# Altium project Fri3D_2026_02.PrjPcb
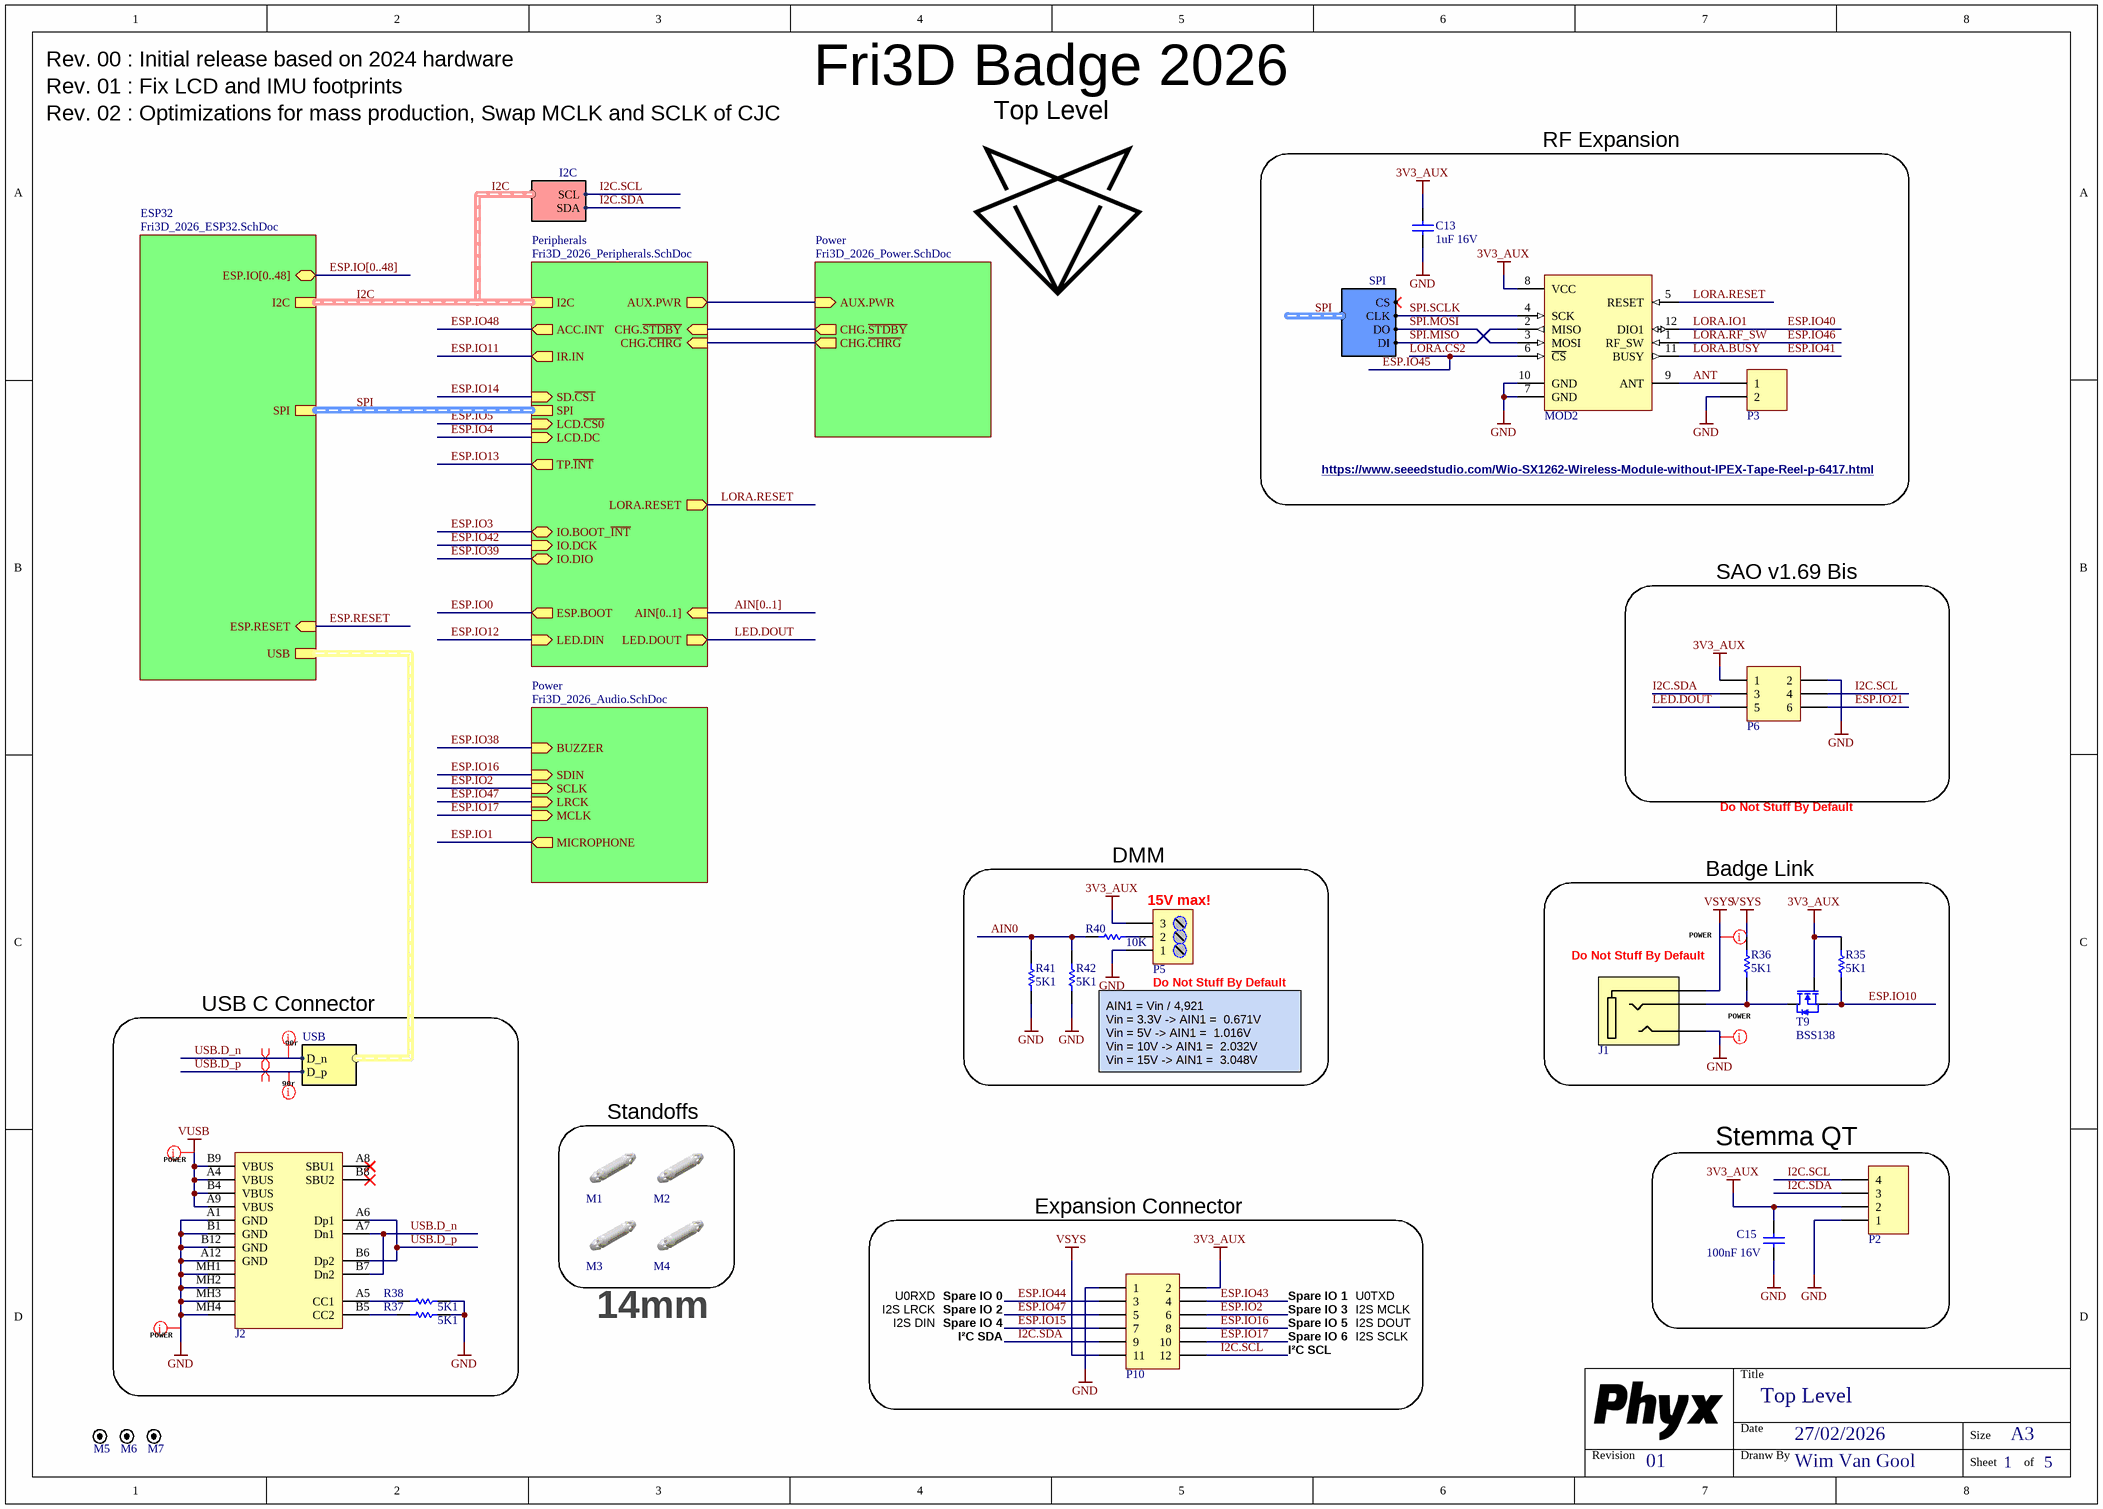
[diagram p0: Fri3D_2026_02.SchDoc]
PCB_ENGINEER: WimVG; PCB_REV: 02; PCB_TITLE: Fri3D Badge 2026
5 sheets, 122 parts. Net scope: hierarchical (ports join the sheet entries above them; power ports are global).
Board file: Fri3D_2026_02.PcbDoc
Sheets:
  Fri3D_2026_02.SchDoc
    Peripherals = Fri3D_2026_Peripherals.SchDoc
    Power = Fri3D_2026_Power.SchDoc
    ESP32 = Fri3D_2026_ESP32.SchDoc
    Power = Fri3D_2026_Audio.SchDoc

## Sheet Fri3D_2026_02.SchDoc: Top Level
size A3; Date: 27/02/2026; DrawnBy: Wim Van Gool; DocumentNumber: 1; Revision: 01; SheetNumber: 1; SheetTotal: 5

### Parts
C13  value 1uF 16V  [C0603_N]
C15  value 100nF 16V  [C0603_N]
J1  3.5mm jack, black, 3 contacts  [SHOU_HAN_PJ-320A-3P]  (value not drawn)
J2  USB 2.0 C Reversible Receptacle Horizontal full SMD  [XUNPU-TYPEC-304S-ACP16]  (value not drawn)
M1  HIWA LCC-12 Snap-in - Snap-in 12.7mm  [WE_709622400]  (value not drawn)
M2  HIWA LCC-12 Snap-in - Snap-in 12.7mm  [WE_709622400]  (value not drawn)
M3  HIWA LCC-12 Snap-in - Snap-in 12.7mm  [WE_709622400]  (value not drawn)
M4  HIWA LCC-12 Snap-in - Snap-in 12.7mm  [WE_709622400]  (value not drawn)
M5  Fiducial 0.5mm  [FID_0.5mm]  (value not drawn)
M6  Fiducial 0.5mm  [FID_0.5mm]  (value not drawn)
M7  Fiducial 0.5mm  [FID_0.5mm]  (value not drawn)
MOD2  868/915MHz 22dBm LoRa Module with Antenna Pin  [SEE_Wio-SX1262]  (value not drawn)
P2  Header 1.0mm RA Shrouded 4  [WE_665104131822]  (value not drawn)
P3  DEALON DL-SMA-K513-08K  [DEA_DL-SMA-K513-08K]  (value not drawn)
P5  3 Way Screw HDR 3.5mm Rising Cage  [WE_691103110003]  (value not drawn)
P6  Receptacle 3x2  [RCPT2X3]  (value not drawn)
P10  Receptacle 6x2 SMD low profile  [WE_610312243021_POST]  (value not drawn)
R35  value 5K1  [R0603_N]
R36  value 5K1  [R0603_N]
R37  value 5K1  [R0603_N]
R38  value 5K1  [R0603_N]
R40  value 10K  [R0603_N]
R41  value 5K1  [R0603_N]
R42  value 5K1  [R0603_N]
T9  value BSS138  [SOT23-3]  (hidden comment: 0.2A N-Ch MOSFET Vgs 3.2)

### Blocks framed on the sheet
RF Expansion: C13 MOD2 P3
SAO v1.69 Bis: P6
DMM: P5 R40-R42
Badge Link: J1 R35 R36 T9
USB C Connector: J2 R37 R38
Standoffs: M1-M4
Stemma QT: C15 P2
Expansion Connector: P10

### Sub-sheets
ESP32 = Fri3D_2026_ESP32.SchDoc: I2C (harness I2C), USB (harness USB), SPI (harness SPI), ESP.RESET (in), ESP.IO[0..48] (bidir)
Peripherals = Fri3D_2026_Peripherals.SchDoc: I2C (harness I2C), ACC.INT (out), LED.DIN (in), LED.DOUT (out), SPI (harness SPI), IR.IN (out), LCD.DC (in), LCD.~{CS0} (in), ESP.BOOT (out), SD.~{CS1} (in), IO.BOOT_~{INT} (bidir), IO.DCK (in), IO.DIO (bidir), AUX.PWR (out), TP.~{INT} (out), CHG.~{STDBY} (in), CHG.~{CHRG} (in), AIN[0..1] (in), LORA.RESET (out)
Power = Fri3D_2026_Power.SchDoc: AUX.PWR (in), CHG.~{STDBY} (out), CHG.~{CHRG} (out)
Power = Fri3D_2026_Audio.SchDoc: BUZZER (in), MICROPHONE (out), SDIN (in), SCLK (in), LRCK (in), MCLK (in)

### Harnesses
USB: D_p, D_n
I2C: SDA, SCL
SPI: CS, CLK, DO, DI

### Nets
3V3_AUX: C13.1 C15.1 MOD2.8(VCC) P2.2 P5.3 P6.1 P10.2 R35.1 T9.1(G)
GND: C13.2 C15.2 J1.2(Tip) J2.A1(GND) J2.A12(GND) J2.B1(GND) J2.B12(GND) J2.MH1(Tab) J2.MH2(Tab) J2.MH3(Tab) J2.MH4(Tab) MOD2.7(GND) MOD2.10(GND) P2.1 P3.2 P5.1 P6.2 P10.1 R37.2 R38.2 R41.1 R42.1
VSYS: J1.1(Sleeve) P10.11 R36.1
VUSB: J2.A4(VBUS) J2.A9(VBUS) J2.B4(VBUS) J2.B9(VBUS)
AIN0: R40.1 R41.2 R42.2
ANT: MOD2.9(ANT) P3.1
AUX.PWR: sheet Peripherals/AUX.PWR, sheet Power/AUX.PWR
~{CHRG}: sheet Peripherals/CHG.~{CHRG}, sheet Power/CHG.~{CHRG}
CHG.~{STDBY}: sheet Peripherals/CHG.~{STDBY}, sheet Power/CHG.~{STDBY}
ESP.IO2: P10.6 ; sheet Power/SCLK
ESP.IO10: R35.2 T9.2(S)
ESP.IO15: P10.7
ESP.IO16: P10.8 ; sheet Power/SDIN
ESP.IO17: P10.10 ; sheet Power/MCLK
ESP.IO21: P6.6
ESP.IO40: MOD2.12(DIO1)  [also labelled LORA.IO1]
ESP.IO41: MOD2.11(BUSY)  [also labelled LORA.BUSY]
ESP.IO43: P10.4
ESP.IO44: P10.3
ESP.IO45: MOD2.6(~{CS})  [also labelled LORA.~{CS2}]
ESP.IO46: MOD2.1(RF_SW)  [also labelled LORA.RF_SW]
ESP.IO47: P10.5 ; sheet Power/LRCK
I2C.SCL: P2.4 P6.4 P10.12 ; sheet Peripherals/I2C.SCL
I2C.SDA: P2.3 P6.3 P10.9 ; sheet Peripherals/I2C.SDA
LED.DOUT: P6.5 ; sheet Peripherals/LED.DOUT
LORA.RESET: MOD2.5(RESET) ; sheet Peripherals/LORA.RESET
SPI.MISO: MOD2.2(MISO) ; sheet Peripherals/SPI.DI  [project net ESP.IO8]
SPI.MOSI: MOD2.3(MOSI) ; sheet Peripherals/SPI.DO  [project net ESP.IO6]
SPI.SCLK: MOD2.4(SCK) ; sheet Peripherals/SPI.CLK  [project net ESP.IO7]
USB.D_n: J2.A7(Dn1) J2.B7(Dn2) ; sheet ESP32/USB.D_n
USB.D_p: J2.A6(Dp1) J2.B6(Dp2) ; sheet ESP32/USB.D_p
NetJ1_3: J1.3(Ring) R36.2 T9.3(D)
NetJ2_A5: J2.A5(CC1) R38.1
NetJ2_B5: J2.B5(CC2) R37.1
NetP5_2: P5.2 R40.2

Not connected (* = marked no-connect by the designer): J2 A8(SBU1)* B8(SBU2)*

### Buses and harness runs
bus AIN[0..1] = sheet Peripherals/AIN[0..1]
bus ESP.IO[0..48] = sheet ESP32/ESP.IO[0..48]
harness I2C = sheet ESP32/I2C = sheet Peripherals/I2C
harness SPI = sheet ESP32/SPI = sheet Peripherals/SPI

### Layout directives
net class 90r: USB.D_n, USB.D_p
differential pair: USB.D_n, USB.D_p
net class POWER: GND, VSYS, VUSB

### Notes on the sheet
- Rev. 00 : Initial release based on 2024 hardware
- Rev. 01 : Fix LCD and IMU footprints
- Rev. 02 : Optimizations for mass production, Swap MCLK and SCLK of CJC
- https://www.seeedstudio.com/Wio-SX1262-Wireless-Module-without-IPEX-Tape-Reel-p-6417.html
- Do Not Stuff By Default
- (near P5) 15V max!
- (near P5) Do Not Stuff By Default
- AIN1 = Vin / 4,921
  Vin = 3.3V -> AIN1 =  0.671V
  Vin = 5V -> AIN1 =  1.016V
  Vin = 10V -> AIN1 =  2.032V
  Vin = 15V -> AIN1 =  3.048V
- 14mm
- I2S LRCK
- I2S DIN
- U0RXD
- Spare IO 0
- I²C SDA
- Spare IO 2
- Spare IO 4
- Spare IO 1
- Spare IO 3
- Spare IO 5
- Spare IO 6
- I2S MCLK
- I2S SCLK
- I2S DOUT
- U0TXD
- I²C SCL
- Title
- Revision
- Date
- Dranw By
- Size
- A3
- Sheet
- of

### Library data of the parts
C13 = CAP # 1uF 16V 0603: Capacitor Ceramic; Supplier 1: Farnell; Supplier Part Number 1: 2320814; Supplier 2: LCSC; Supplier 3: Generic; Supplier Part Number 2: C1592; Supplier Part Number 3: 1uF 16V 0603 X7R
C15 = CAP # 100nF 16V 0603: Capacitor Ceramic; Supplier 1: LCSC; Supplier 3: Generic; Supplier Part Number 1: C282519; Supplier Part Number 3: 100nF 16V 0603 X7R
J1 = AUDIO JACK 3.5 3c PJ-320A-3P: =Description; Value: PJ-320A-3P; Supplier 1: LCSC; Supplier Part Number 1: C17701689; Supplier 2: LCSC; Supplier Part Number 2: C19189087
J2 = USB # C 2.0 RCPT TYPEC-304S-ACP16: Value: TYPEC-304S-ACP16; Supplier 1: LCSC; Supplier Part Number 1: C5187472; Supplier 2: LCSC; Supplier 3: LCSC; Supplier Part Number 2: C2927040; Supplier Part Number 3: C5156603
M1-M4 = SPACER SNAP-SNAP LCC-12 -12.7mm: Value: LCC-12; Supplier 1: LCSC; Supplier Part Number 1: C155856
M5-M7 = Fiducial 0.5mm: FIDUCIAL; Value: NO BOM; Supplier 1: XXX; Supplier Part Number 1: FOOTPRINT ONLY
MOD2 = RF # MOD Wio-SX1262-N 868MHz LoRa ANT pin: =Description; Value: Wio-SX1262-N; Supplier 1: Seeed Studio; Supplier Part Number 1: 113991436; Supplier 2: Digi-key; Supplier Part Number 2: 1597-113991436-ND
P2 = HDR # RA SHR 1.0mm 4way - 665104131822: Value: 665104131822; Supplier 1: Wurth; Supplier Part Number 1: 665104131822; Supplier 2: Mouser; Supplier Part Number 2: 710-665104131822; Supplier 3: LCSC; Supplier Part Number 3: C2905006
P3 = RF # SMA DL-SMA-K513-08K: Value: DL-SMA-K513-08K; Supplier 1: LCSC; Supplier Part Number 1: C4749212
P5 = Terminal Block 3.5mm 3way: Supplier 1: LCSC; Supplier Part Number 1: C784941; Supplier 2: Würth; Supplier Part Number 2: 691214110003
P6 = Receptacle 2.54mm dual row 6way: Supplier 1: LCSC; Supplier 2: LCSC; Supplier Part Number 1: C92272; Supplier Part Number 2: C358725
P10 = Receptacle # 2.54mm dual row 12way 610312243021: Value: 610312243021; Supplier 1: Wurth; Supplier Part Number 1: 610312243021; Supplier 2: Mouser; Supplier Part Number 2: 710-610312243021
R35-R38 R41 R42 = RES # 5K1 0603: Supplier 1: Farnell; Supplier Part Number 1: 2845922; Supplier 2: LCSC; Supplier 3: Generic; Supplier Part Number 2: C112314; Supplier Part Number 3: 5K1 1% 0603
R40 = RES # 10K 0603: Supplier 1: Farnell; Supplier Part Number 1: 2502397; Supplier 2: LCSC; Supplier 3: Generic; Supplier Part Number 2: C25804; Supplier Part Number 3: 10K 1% 0603
T9 = BSS138 N-Ch MOSFET 0.2A 3.2Vgs 60Vds: Supplier 1: Farnell; Supplier Part Number 1: 2432717

## Sheet Fri3D_2026_Peripherals.SchDoc: Peripherals
size A3; Date: 27/02/2026; DrawnBy: Wim Van Gool; DocumentNumber: 3; Revision: 01; SheetNumber: 3; SheetTotal: 5
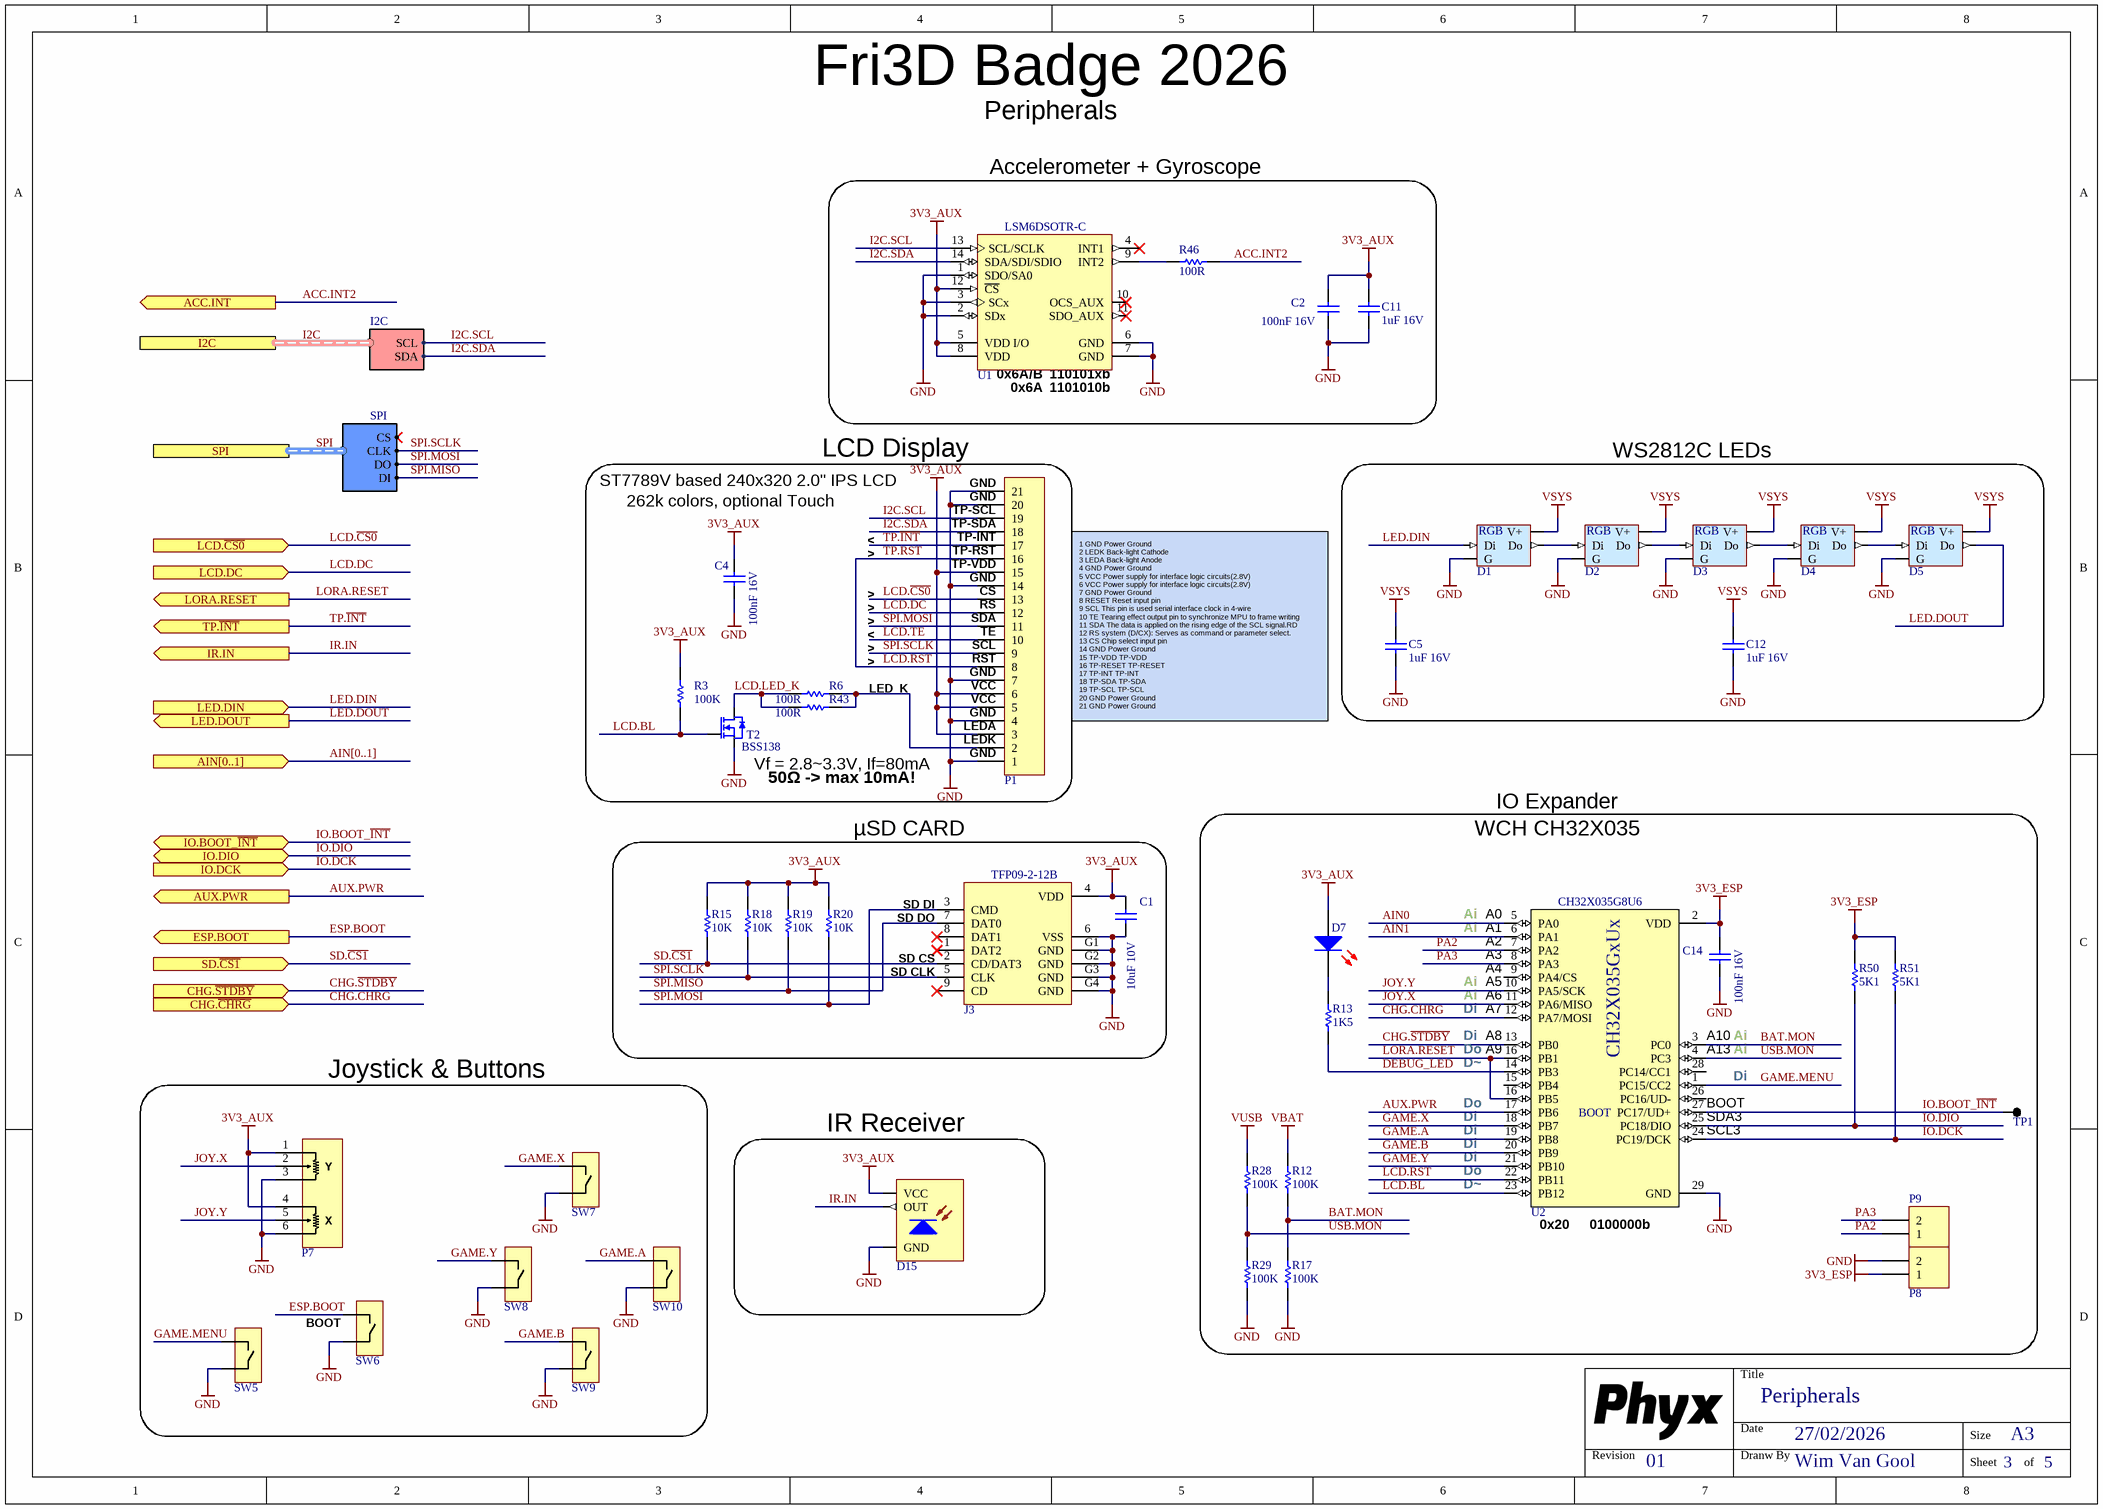
[diagram p1: Fri3D_2026_Peripherals.SchDoc]

### Parts
C1  value 10uF 10V  [C0805_N]
C2  value 100nF 16V  [C0603_N]
C4  value 100nF 16V  [C0603_N]
C5  value 1uF 16V  [C0603_N]
C11  value 1uF 16V  [C0603_N]
C12  value 1uF 16V  [C0603_N]
C14  value 100nF 16V  [C0603_N]
D1  WS2812 based digital RGB LED 5050 White package reduced current  [LED_5050_WS2812B_WHITE]  (value not drawn)
D2  WS2812 based digital RGB LED 5050 White package reduced current  [LED_5050_WS2812B_WHITE]  (value not drawn)
D3  WS2812 based digital RGB LED 5050 White package reduced current  [LED_5050_WS2812B_WHITE]  (value not drawn)
D4  WS2812 based digital RGB LED 5050 White package reduced current  [LED_5050_WS2812B_WHITE]  (value not drawn)
D5  WS2812 based digital RGB LED 5050 White package reduced current  [LED_5050_WS2812B_WHITE]  (value not drawn)
D7  Default 0805 Red LED  [LED_0805_RD]  (value not drawn)
D15  ZIRM-5042B-42-Z2 Infrared Receiver 38 kHz 45° 2.7-5.5V 940nm  [CHAU_ZIRM-5042B-42-Z2]  (value not drawn)
J3  Micro SD PiPo Push-Push  [TFP09-2-12B]  (value not drawn)
P1  FH35C-21S-0.3SHW Top and Bottom Contacts 0.3mm 21pin  [HRS_FH35C-21S-0.3SHW]  (value not drawn)
P7  PSP Mini Joystick  [PSP_Mini_Joystick]  (value not drawn)
P8  Header 2  [HDR1X2]  (value not drawn)
P9  Header 2  [HDR1X2]  (value not drawn)
R3  value 100K  [R0603_N]
R6  value 100R  [R0603_N]
R12  value 100K  [R0603_N]
R13  value 1K5  [R0603_N]
R15  value 10K  [R0603_N]
R17  value 100K  [R0603_N]
R18  value 10K  [R0603_N]
R19  value 10K  [R0603_N]
R20  value 10K  [R0603_N]
R28  value 100K  [R0603_N]
R29  value 100K  [R0603_N]
R43  value 100R  [R0603_N]
R46  value 100R  [R0603_N]
R50  value 5K1  [R0603_N]
R51  value 5K1  [R0603_N]
SW5  SKPMAME010 6x6 TACTG Switch  [ALPS_SKPMAME010]  (value not drawn)
SW6  SKPMAME010 6x6 TACTG Switch  [ALPS_SKPMAME010]  (value not drawn)
SW7  SKPMAME010 6x6 TACTG Switch  [ALPS_SKPMAME010]  (value not drawn)
SW8  SKPMAME010 6x6 TACTG Switch  [ALPS_SKPMAME010]  (value not drawn)
SW9  SKPMAME010 6x6 TACTG Switch  [ALPS_SKPMAME010]  (value not drawn)
SW10  SKPMAME010 6x6 TACTG Switch  [ALPS_SKPMAME010]  (value not drawn)
T2  value BSS138  [SOT23-3]  (hidden comment: 0.2A N-Ch MOSFET Vgs 3.2)
TP1  TEST_PAD  [TP_1.5mm_0.9mm]  (value not drawn)
U1  value LSM6DSOTR-C  [STM_LGA14_2.5x3]  (hidden comment: Acceleration ±2, ±4, ±8, ±16g Gyro ±125, ±250, ±500, ±1000, ±2000dps)
U2  value CH32X035G8U6  [QFN_28_4.0x4.0_P0.4]  (hidden comment: WCH CH32X035G8U6 QFN28 RISC-V 32-bit MCU, 62KB Flash, 10KB RAM, USB PD)

### Blocks framed on the sheet
Accelerometer + Gyroscope: C2 C11 R46 U1
LCD Display: C4 P1 R3 R6 R43 T2
WS2812C LEDs: C5 C12 D1-D5
µSD CARD: C1 J3 R15 R18-R20
Joystick & Buttons: P7 SW5-SW10
IR Receiver: D15

### Ports
ACC.INT (out), AIN[0..1] (in), AUX.PWR (out), CHG.~{CHRG} (in), CHG.~{STDBY} (in), ESP.BOOT (out), I2C (harness I2C), IO.BOOT_~{INT} (bidir), IO.DCK (in), IO.DIO (bidir), IR.IN (out), LCD.DC (in), LCD.~{CS0} (in), LED.DIN (in), LED.DOUT (out), LORA.RESET (out), SD.~{CS1} (in), SPI (harness SPI), TP.~{INT} (out)

### Harnesses
I2C: SDA, SCL
SPI: CS, CLK, DO, DI

### Nets
3V3_AUX: C1.1 C2.1 C4.1 C11.1 D7.1(A) D15.3(VCC) J3.4(VDD) P1.3 P1.5 P1.6 P1.15 P7.1 P7.4 R3.1 R15.1 R18.1 R19.1 R20.1 U1.5(VDD_I/O) U1.8(VDD) U1.12(~{CS})
3V3_ESP: C14.1 P8.1 R50.1 R51.1 U2.2(VDD)
GND: C1.2 C2.2 C4.2 C5.2 C11.2 C12.2 C14.2 D1.3(G) D2.3(G) D3.3(G) D4.3(G) D5.3(G) D15.2(GND) J3.6(VSS) J3.G1(GND) J3.G2(GND) J3.G3(GND) J3.G4(GND) P1.1 P1.4 P1.7 P1.14 P1.20 P1.21 P7.3 P7.6 P8.2 R17.2 R29.2 SW5.2 SW6.2 SW7.2 SW8.2 SW9.2 SW10.2 T2.2(S) U1.1(SDO/SA0) U1.2(SDx) U1.3(SCx) U1.6(GND) U1.7(GND) U2.29(GND)
VBAT: R12.1
VSYS: C5.1 C12.1 D1.1(V+) D2.1(V+) D3.1(V+) D4.1(V+) D5.1(V+)
VUSB: R28.1
ACC.INT2: R46.2 ; port ACC.INT
AIN0: U2.5(PA0)
AIN1: U2.6(PA1)
AUX.PWR: U2.17(PB6) ; port AUX.PWR
BAT.MON: R12.2 R17.1 U2.3(PC0)
CHG.~{CHRG}: U2.12(PA7/MOSI) ; port CHG.~{CHRG}  [project net ~{CHRG}]
CHG.~{STDBY}: U2.13(PB0) ; port CHG.~{STDBY}
DEBUG_LED: R13.2 U2.14(PB3)
ESP.BOOT: SW6.1 ; port ESP.BOOT
GAME.A: SW10.1 U2.19(PB8)
GAME.B: SW9.1 U2.20(PB9)
GAME.MENU: SW5.1 U2.1(PC15/CC2)
GAME.X: SW7.1 U2.18(PB7)
GAME.Y: SW8.1 U2.21(PB10)
I2C.SCL: P1.19 U1.13(SCL/SCLK) ; port I2C.SCL
I2C.SDA: P1.18 U1.14(SDA/SDI/SDIO) ; port I2C.SDA
IO.BOOT_~{INT}: TP1.1 U2.27(PC17/UD+) ; port IO.BOOT_~{INT}  [project net ESP.IO3]
IO.DCK: R51.2 U2.24(PC19/DCK) ; port IO.DCK  [project net ESP.IO42]
IO.DIO: R50.2 U2.25(PC18/DIO) ; port IO.DIO  [project net ESP.IO39]
IR.IN: D15.1(OUT) ; port IR.IN  [project net ESP.IO11]
JOY.X: P7.2 U2.11(PA6/MISO)
JOY.Y: P7.5 U2.10(PA5/SCK)
LCD.BL: R3.2 T2.1(G) U2.23(PB12)
LCD.~{CS0}: P1.13 ; port LCD.~{CS0}  [project net ESP.IO5]
LCD.DC: P1.12 ; port LCD.DC  [project net ESP.IO4]
LCD.LED_K: R6.2 R43.2 T2.3(D)
LCD.~{RST}: P1.8 P1.16 U2.22(PB11)  [also labelled TP.RST]
LCD.TE: P1.10
LED.DIN: D1.4(Di) ; port LED.DIN  [project net ESP.IO12]
LED.DOUT: D5.2(Do) ; port LED.DOUT
LORA.RESET: U2.16(PB1) ; port LORA.RESET
PA2: P9.1 U2.7(PA2)
PA3: P9.2 U2.8(PA3)
SD.~{CS1}: J3.2(CD/DAT3) R15.2 ; port SD.~{CS1}  [project net ESP.IO14]
SPI.MISO: J3.7(DAT0) R19.2 ; port SPI.DI  [project net ESP.IO8]
SPI.MOSI: J3.3(CMD) P1.11 R20.2 ; port SPI.DO  [project net ESP.IO6]
SPI.SCLK: J3.5(CLK) P1.9 R18.2 ; port SPI.CLK  [project net ESP.IO7]
TP.~{INT}: P1.17 ; port TP.~{INT}  [project net ESP.IO13]
USB.MON: R28.2 R29.1 U2.4(PC3)
NetD1_2: D1.2(Do) D2.4(Di)
NetD2_2: D2.2(Do) D3.4(Di)
NetD3_2: D3.2(Do) D4.4(Di)
NetD4_2: D4.2(Do) D5.4(Di)
NetD7_2: D7.2(K) R13.1
NetP1_2: P1.2 R6.1 R43.1
NetR46_1: R46.1 U1.9(INT2)

Not connected (* = marked no-connect by the designer): J3 1(DAT2)* 8(DAT1)* 9(CD)*; U1 4(INT1)* 10(OCS_AUX)* 11(SDO_AUX)*; U2 9(PA4/CS) 15(PB4) 26(PC16/UD-) 28(PC14/CC1)

### Buses and harness runs
bus AIN[0..1] = port AIN[0..1]
harness I2C = port I2C
harness SPI = port SPI

### Notes on the sheet
- (near U1) 0x6A/B
- (near U1) 110101xb
- (near U1) 0x6A
- (near U1) 1101010b
- ST7789V based 240x320 2.0" IPS LCD
- 262k colors, optional Touch
- (near P1) GND
- (near P1) TP-SCL
- >
- <
- (near P1) TP-SDA
- (near P1) TP-INT
- (near P1) TP-RST
- (near P1) TP-VDD
- (near P1) CS
- (near P1) RS
- (near P1) SDA
- (near P1) TE
- (near P1) SCL
- LED_K
- (near P1) RST
- (near P1) VCC
- 1 GND Power Ground
  2 LEDK Back-light Cathode
  3 LEDA Back-light Anode
  4 GND Power Ground
  5 VCC Power supply for interface logic circuits(2.8V)
  6 VCC Power supply for interface logic circuits(2.8V)
  7 GND Power Ground
  8 RESET Reset input pin
  9 SCL This pin is used serial interface clock in 4-wire
  10 TE Tearing effect output pin to synchronize MPU to frame writing
  11 SDA The data is applied on the rising edge of the SCL signal.RD
  12 RS system (D/CX): Serves as command or parameter select.
  13 CS Chip select input pin
  14 GND Power Ground
  15 TP-VDD TP-VDD
  16 TP-RESET TP-RESET
  17 TP-INT TP-INT
  18 TP-SDA TP-SDA
  19 TP-SCL TP-SCL
  20 GND Power Ground
  21 GND Power Ground
- (near T2) Vf = 2.8~3.3V, If=80mA
- 50Ω -> max 10mA!
- (near P1) LEDA
- (near P1) LEDK
- IO Expander
- WCH CH32X035
- (near J3) SD DI
- (near J3) SD DO
- Ai
- (near U2) A0
- (near J3) SD CS
- (near J3) SD CLK
- (near U2) A1
- (near U2) A2
- (near U2) A3
- (near U2) A4
- (near U2) A5
- Di
- Do
- (near U2) A6
- (near U2) A7
- (near U2) A8
- (near U2) A9
- (near U2) A10
- (near U2) A13
- D~
- (near U2) BOOT
- (near U2) SDA3
- (near U2) SCL3
- (near U2) 0x20
- (near U2) 0100000b
- (near SW6) BOOT
- Title
- Revision
- Date
- Dranw By
- Size
- Sheet
- of
- (in symbol JOY # PSP Mini Joystick) Y; X
- (in symbol LED # RGB WS2812C-5050 WH) RGB
- (in symbol RISCV # CH32X035G8U6) CH32X035GxUx; BOOT

### Library data of the parts
C1 = CAP # 10uF 10V 0805: Capacitor Ceramic; Supplier 1: Farnell; Supplier Part Number 1: 2320859; Supplier 2: LCSC; Supplier 3: Generic; Supplier Part Number 2: C17024; Supplier Part Number 3: 10uF 10V 0805 X7R
C2 C4 C14 = CAP # 100nF 16V 0603: Capacitor Ceramic; Supplier 1: LCSC; Supplier 3: Generic; Supplier Part Number 1: C282519; Supplier Part Number 3: 100nF 16V 0603 X7R
C5 C11 C12 = CAP # 1uF 16V 0603: Capacitor Ceramic; Supplier 1: Farnell; Supplier Part Number 1: 2320814; Supplier 2: LCSC; Supplier 3: Generic; Supplier Part Number 2: C1592; Supplier Part Number 3: 1uF 16V 0603 X7R
D1-D5 = LED # RGB WS2812C-5050 WH: =Description; Value: WS218C 5050 WH; Supplier 1: Aliexpress; Supplier Part Number 1: WS2812C Black 5050; Supplier 2: LCSC; Supplier Part Number 2: C114587
D7 = LED # Red 0805: =Description; Supplier 1: Farnell; Supplier Part Number 1: 2099236; Supplier 2: LCSC; Supplier Part Number 2: C965812
D15 = PHO # IR Rx 940nm ZIRM-5042B-42-Z2: =Description; Value: ZIRM-5042B-42-Z2; Supplier 1: LCSC; Supplier Part Number 1: C575386
J3 = MicroSD TFP09-2-12B Push-Push: =Description; Value: TFP09-2-12B; Supplier 1: AliExpress; Supplier Part Number 1: TFP09-2-12B; Supplier 2: LCSC; Supplier 3: LCSC; Supplier Part Number 2: C393941; Supplier Part Number 3: C381082
P1 = ZIF # 0.3mm 21p FH35C-21S-0.3SHW(50): Value: FH35C-21S-0.3SHW(50); Supplier 1: LCSC; Supplier Part Number 1: C5242964; Supplier 2: Digi-key; Supplier Part Number 2: 26-FH35C-21S-0.3SHW(50)CT-ND; Supplier 3: LCSC; Supplier Part Number 3: C48688891
P7 = JOY # PSP Mini Joystick: Value: PSP Mini Joystick; Supplier 1: AliExpress; Supplier Part Number 1: 32958017132; Supplier 2: TaoBao; Supplier Part Number 2: 606257885046
P8 P9 = Pin Header 2.54mm 2way: Supplier 1: LCSC; Supplier Part Number 1: C492401; Supplier 2: LCSC; Supplier Part Number 2: C541856
R3 R12 R17 R28 R29 = RES # 100K 0603: Supplier 3: Generic; Supplier Part Number 3: 100K 1% 0603; Supplier 1: LCSC; Supplier 2: LCSC; Supplier Part Number 1: C25803; Supplier Part Number 2: C14675
R6 R43 R46 = RES # 100R 0603: Supplier 1: Farnell; Supplier 2: LCSC; Supplier 3: Generic; Supplier Part Number 1: 2446544; Supplier Part Number 2: C22775; Supplier Part Number 3: 100R 1% 0603
R13 = RES # 1K5 0603: Supplier 3: Generic; Supplier Part Number 3: 1K5 1% 0603; Supplier 1: LCSC; Supplier 2: LCSC; Supplier Part Number 1: C2930050; Supplier Part Number 2: C114668
R15 R18-R20 = RES # 10K 0603: Supplier 1: Farnell; Supplier Part Number 1: 2502397; Supplier 2: LCSC; Supplier 3: Generic; Supplier Part Number 2: C25804; Supplier Part Number 3: 10K 1% 0603
R50 R51 = RES # 5K1 0603: Supplier 3: Generic; Supplier Part Number 3: 5K1 1% 0603; Supplier 1: Farnell; Supplier Part Number 1: 2845922; Supplier 2: LCSC; Supplier Part Number 2: C112314
SW5-SW10 = SW # TACT ALPS SKPMAME010: Value: SKPMAME010; Supplier 1: LCSC; Supplier Part Number 1: C115348; Supplier 2: Farnell; Supplier Part Number 2: 2056804; Supplier 3: Mouser; Supplier Part Number 3: 688-SKPMAM
T2 = BSS138 N-Ch MOSFET 0.2A 3.2Vgs 60Vds: Supplier 1: Farnell; Supplier Part Number 1: 2432717
TP1 = TP 1.5mm: Value: NO BOM
U1 = ACCELERO GYRO # LSM6DSOTR-C: =Description; Supplier 1: LCSC; Supplier Part Number 1: C2655100; Supplier 2: Mouser; Supplier Part Number 2: 511-LSM6DSOTR; Supplier 3: EBV; Supplier Part Number 3: LSM6DSOTR
U2 = RISCV # CH32X035G8U6: Supplier 1: LCSC; Supplier Part Number 1: C7437027

## Sheet Fri3D_2026_Power.SchDoc: Power
size A3; Date: 27/02/2026; DrawnBy: Wim Van Gool; DocumentNumber: 5; Revision: 01; SheetNumber: 5; SheetTotal: 5
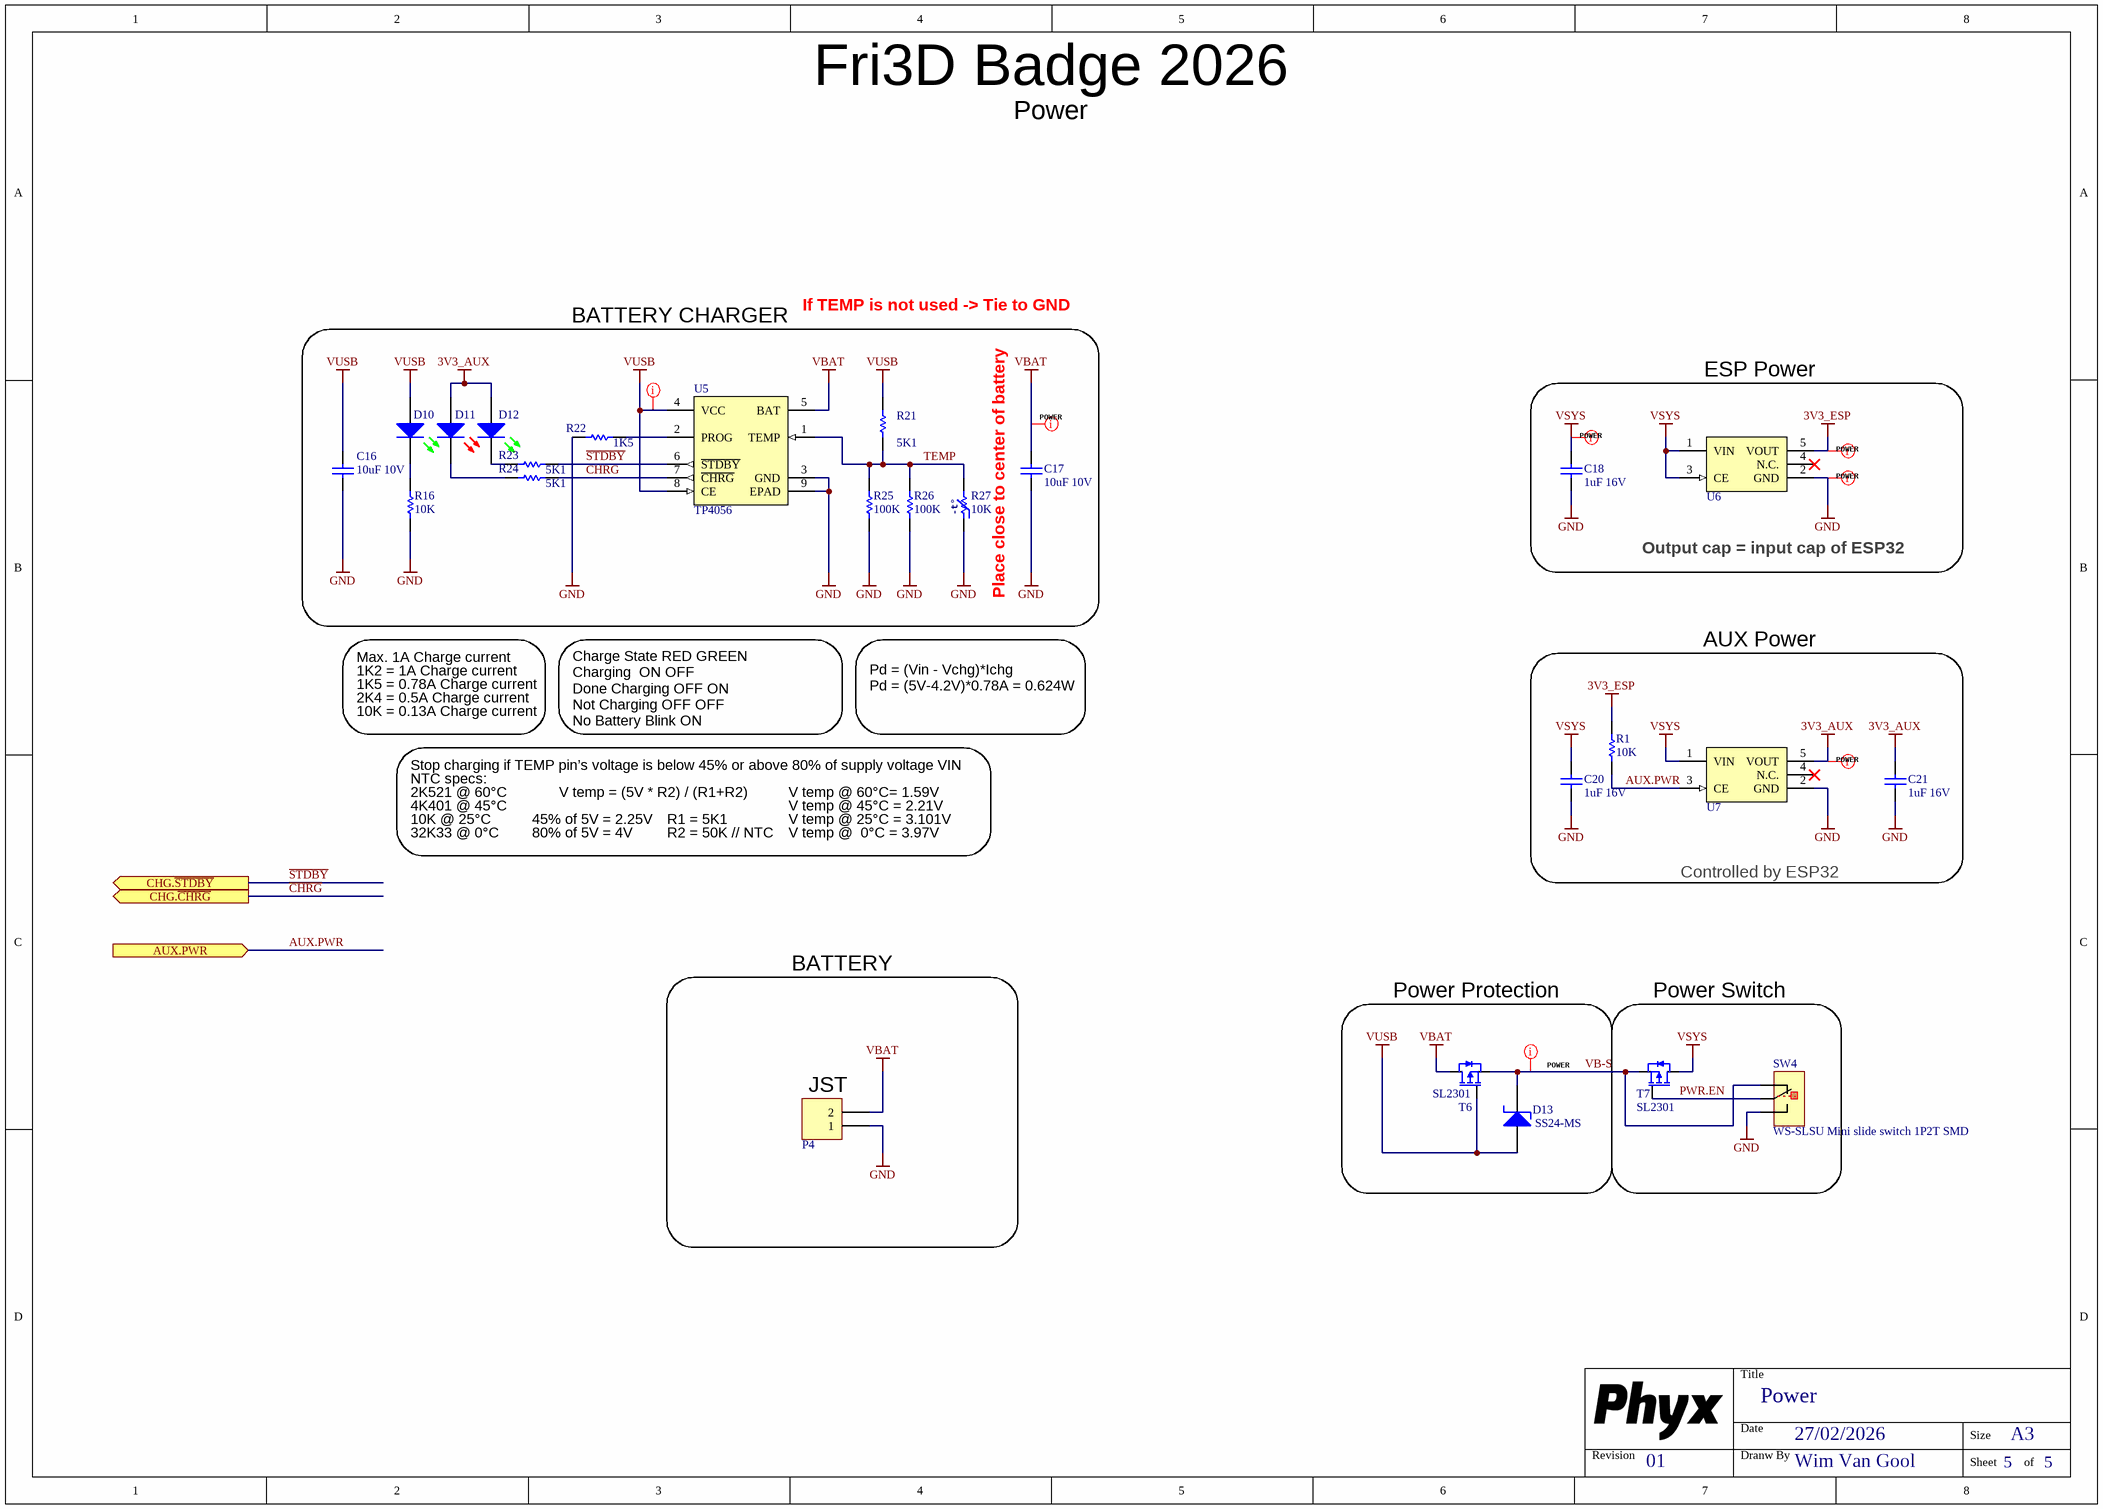
[diagram p2: Fri3D_2026_Power.SchDoc]

### Parts
C16  value 10uF 10V  [C0805_N]
C17  value 10uF 10V  [C0805_N]
C18  value 1uF 16V  [C0603_N]
C20  value 1uF 16V  [C0603_N]
C21  value 1uF 16V  [C0603_N]
D10  Default 0805 Green LED  [LED_0805_GR]  (value not drawn)
D11  Default 0805 Red LED  [LED_0805_RD]  (value not drawn)
D12  Default 0805 Green LED  [LED_0805_GR]  (value not drawn)
D13  value SS24-MS  [DO-214AC_AC]  (hidden comment: 40V 2A 550mV@2A DO-214 Schottky)
P4  Header RA 1.5mm Shrouded S2B-ZR-SM4A-TF  [JST_ZH_S2B-ZR-SM4A-TF]  (value not drawn)
R1  value 10K  [R0603_N]
R16  value 10K  [R0603_N]  (hidden comment: RESISTOR)
R21  value 5K1  [R0603_N]
R22  value 1K5  [R0603_N]
R23  value 5K1  [R0603_N]
R24  value 5K1  [R0603_N]
R25  value 100K  [R0603_N]
R26  value 100K  [R0603_N]
R27  value 10K  [R0402]
SW4  WS-SLSU Mini slide switch 1P2T SMD  [WE_450404015514]
T6  value SL2301  [SOT23-3]  (hidden comment: -2.3A -20V P-Ch MOSFET Vgs -1V)
T7  value SL2301  [SOT23-3]  (hidden comment: -2.3A -20V P-Ch MOSFET Vgs -1V)
U5  value TP4056  [SOIC_N_8_TH]  (hidden comment: Single Cell LiIon charger max 1A)
U6  3V3 LDO 700mA 50mV  [SOT23-5]  (value not drawn)
U7  3V3 LDO 700mA 50mV  [SOT23-5]  (value not drawn)

### Blocks framed on the sheet
BATTERY CHARGER: C16 C17 D10-D12 R16 R21-R27 U5
ESP Power: C18 U6
AUX Power: C20 C21 R1 U7
Power Protection: D13 T6
Power Switch: SW4 T7

### Ports
AUX.PWR (in), CHG.~{CHRG} (out), CHG.~{STDBY} (out)

### Nets
3V3_AUX: C21.1 D11.1(A) D12.1(A) U7.5(VOUT)
3V3_ESP: R1.1 U6.5(VOUT)
GND: C16.2 C17.2 C18.2 C20.2 C21.2 P4.1 R16.2 R22.2 R25.2 R26.2 R27.2 SW4.3 U5.3(GND) U5.9(EPAD) U6.2(GND) U7.2(GND)
VBAT: C17.1 P4.2 T6.3(D) U5.5(BAT)
VSYS: C18.1 C20.1 T7.3(D) U6.1(VIN) U6.3(CE) U7.1(VIN)
VUSB: C16.1 D10.1(A) D13.A R21.1 T6.1(G) U5.4(VCC) U5.8(CE)
AUX.PWR: R1.2 U7.3(CE) ; port AUX.PWR
~{CHRG}: R24.2 U5.7(~{CHRG}) ; port CHG.~{CHRG}
PWR.EN: SW4.2 T7.1(G)
~{STDBY}: R23.2 U5.6(~{STDBY}) ; port CHG.~{STDBY}  [project net CHG.~{STDBY}]
TEMP: R21.2 R25.1 R26.1 R27.1 U5.1(TEMP)
VB-S: D13.C SW4.1 T6.2(S) T7.2(S)
NetD10_2: D10.2(K) R16.1
NetD11_2: D11.2(K) R24.1
NetD12_2: D12.2(K) R23.1
NetR22_1: R22.1 U5.2(PROG)

Not connected (* = marked no-connect by the designer): U6 4(N.C.)*; U7 4(N.C.)*

### Layout directives
net class POWER: 3V3_AUX, 3V3_ESP, GND, VB-S, VBAT, VSYS, VUSB

### Notes on the sheet
- If TEMP is not used -> Tie to GND
- Place close to center of battery
- Output cap = input cap of ESP32
- 1K2 = 1A Charge current
- 2K4 = 0.5A Charge current
- Max. 1A Charge current
- 10K = 0.13A Charge current
- 1K5 = 0.78A Charge current
- Charge State	RED	GREEN
  Charging		ON	OFF
  Done Charging	OFF	ON
  Not Charging	OFF	OFF
  No Battery	Blink	ON
- Pd = (Vin - Vchg)*Ichg
  Pd = (5V-4.2V)*0.78A = 0.624W
- Stop charging if TEMP pin’s voltage is below 45% or above 80% of supply voltage VIN
- NTC specs:
- 10K @ 25°C
- 32K33 @ 0°C
- 2K521 @ 60°C
- 4K401 @ 45°C
- 45% of 5V = 2.25V
- 80% of 5V = 4V
- V temp = (5V * R2) / (R1+R2)
- R1 = 5K1
- R2 = 50K // NTC
- V temp @ 60°C= 1.59V
- V temp @ 45°C = 2.21V
- V temp @ 25°C = 3.101V
- V temp @  0°C = 3.97V
- Controlled by ESP32
- BATTERY
- (near P4) JST
- Title
- Revision
- Date
- Dranw By
- Size
- A3
- Sheet
- of
- (in symbol NTC # 10K 0402) -t°

### Library data of the parts
C16 C17 = CAP # 10uF 10V 0805: Capacitor Ceramic; Supplier 1: Farnell; Supplier Part Number 1: 2320859; Supplier 2: LCSC; Supplier 3: Generic; Supplier Part Number 2: C17024; Supplier Part Number 3: 10uF 10V 0805 X7R
C18 C20 C21 = CAP # 1uF 16V 0603: Capacitor Ceramic; Supplier 1: Farnell; Supplier Part Number 1: 2320814; Supplier 2: LCSC; Supplier 3: Generic; Supplier Part Number 2: C1592; Supplier Part Number 3: 1uF 16V 0603 X7R
D10 D12 = LED # Green 0805: =Description; Supplier 1: Farnell; Supplier Part Number 1: 2099239; Supplier 2: LCSC; Supplier Part Number 2: C965815
D11 = LED # Red 0805: =Description; Supplier 1: Farnell; Supplier Part Number 1: 2099236; Supplier 2: LCSC; Supplier Part Number 2: C965812
D13 = Schottky # SS24-MS: =Description; Supplier 1: LCSC; Supplier Part Number 1: C2836395
P4 = HDR # RA SHR 1.5mm 2way - S2B-ZR-SM4A-TF: Value: S2B-ZR-SM4A-TF; Supplier 1: LCSC; Supplier Part Number 1: C265329; Supplier 2: Farnell; Supplier Part Number 2: 1830920; Supplier 3: Digi-Key; Supplier Part Number 3: 455-1693-1-ND
R1 = RES # 10K 0603: Supplier 1: Farnell; Supplier Part Number 1: 2502397; Supplier 2: LCSC; Supplier 3: Generic; Supplier Part Number 2: C25804; Supplier Part Number 3: 10K 1% 0603
R16 = RES # 10k 0603: Supplier 1: Farnell; Supplier Part Number 1: 2502397; Supplier 2: LCSC; Supplier Part Number 2: C25804; Supplier 3: Generic; Supplier Part Number 3: 10K 1% 0603; Description: RES # 10K 0603
R21 R23 R24 = RES # 5K1 0603: Supplier 1: Farnell; Supplier Part Number 1: 2845922; Supplier 2: LCSC; Supplier 3: Generic; Supplier Part Number 2: C112314; Supplier Part Number 3: 5K1 1% 0603
R22 = RES # 1K5 0603: Supplier 3: Generic; Supplier Part Number 3: 1K5 1% 0603; Supplier 1: LCSC; Supplier 2: LCSC; Supplier Part Number 1: C2930050; Supplier Part Number 2: C114668
R25 R26 = RES # 100K 0603: Supplier 1: LCSC; Supplier 2: LCSC; Supplier 3: Generic; Supplier Part Number 1: C25803; Supplier Part Number 2: C14675; Supplier Part Number 3: 100K 1% 0603
R27 = NTC # 10K 0402: Supplier 1: LCSC; Supplier Part Number 1: C209959; Supplier 2: LCSC; Supplier Part Number 2: C98099
SW4 = SW # 1P2T WS-SLSU mini slide 6,7 x 2,7 mm: Value: 450404015514; Supplier 1: Digi-key; Supplier 2: LCSC; Supplier Part Number 1: 732-13665-1-ND; Supplier Part Number 2: C431540
T6 T7 = SL2301 P-Ch MOSFET -2.3A -20Vds: =Description; Supplier 1: LCSC; Supplier Part Number 1: C181086
U5 = CHG # TP4056 LiIon 1A: =Description; Supplier 1: Aliexpress; Supplier Part Number 1: TP4056; Supplier 2: LCSC; Supplier Part Number 2: C382139
U6 U7 = LDO # 3V3 XC6210B33: =Designator; Value: XC6210B332MR; Supplier 1: Farnell; Supplier Part Number 1: 1057803; Supplier 2: LCSC; Supplier Part Number 2: C47719

## Sheet Fri3D_2026_ESP32.SchDoc: ESP32-S3 Module
size A3; Date: 27/02/2026; DrawnBy: Wim Van Gool; DocumentNumber: 2; Revision: 01; SheetNumber: 2; SheetTotal: 5
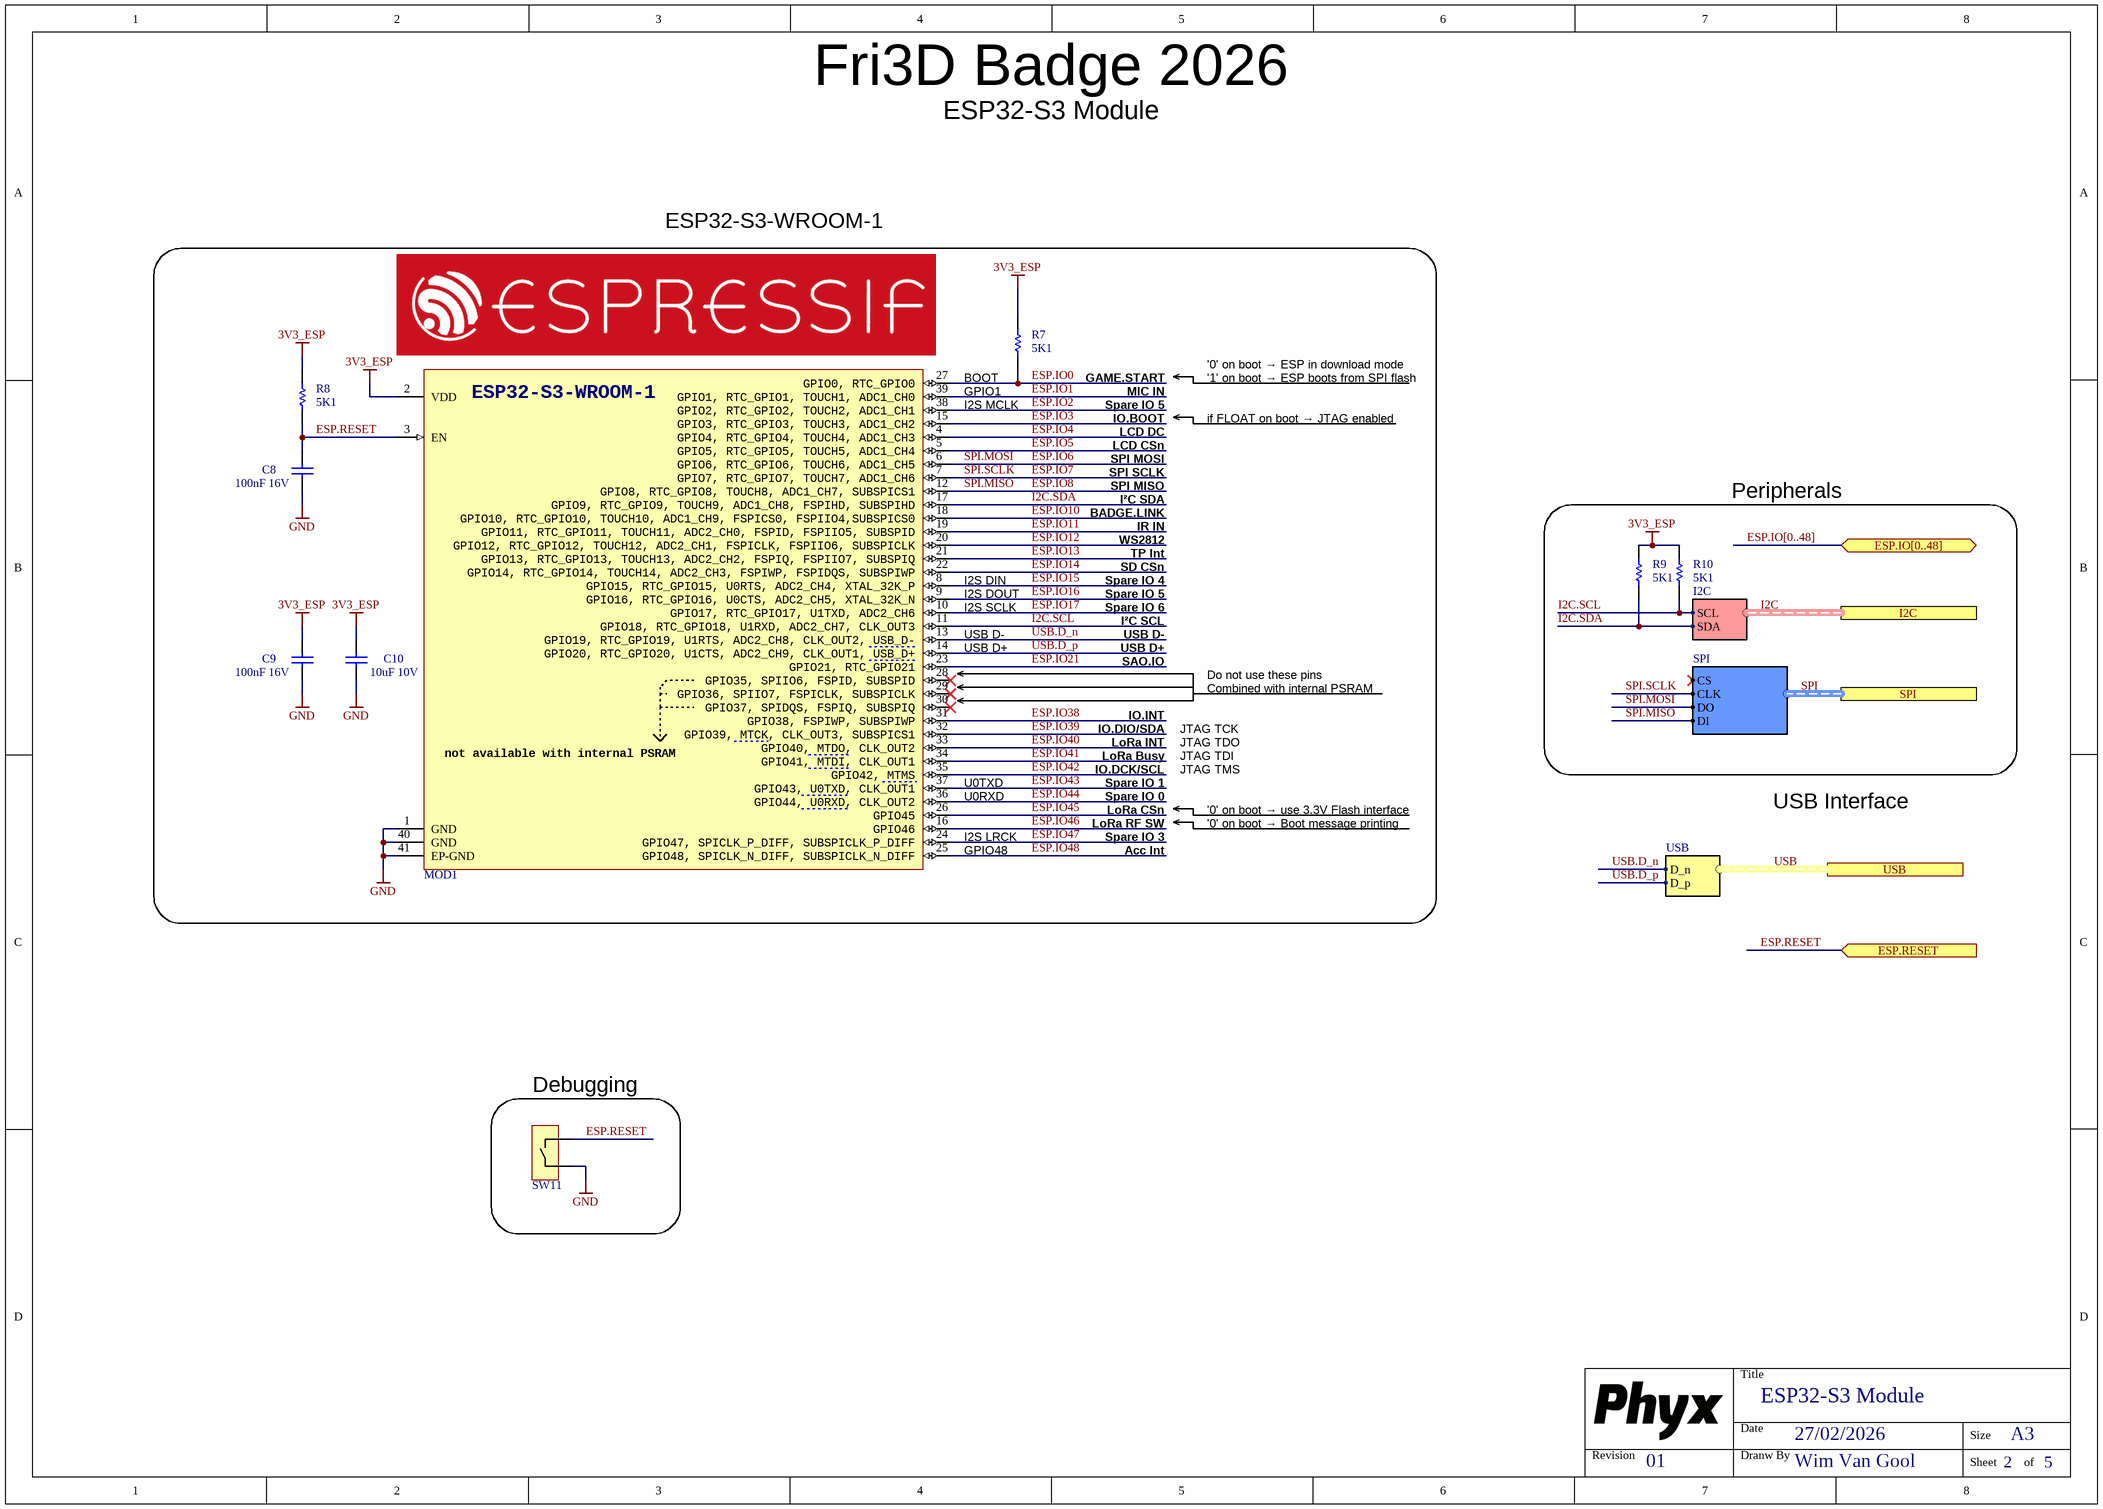
[diagram p3: Fri3D_2026_ESP32.SchDoc]

### Parts
C8  value 100nF 16V  [C0603_N]
C9  value 100nF 16V  [C0603_N]
C10  value 10uF 10V  [C0805_N]
MOD1  ESP32-S3 based WROOM-1 16MB Flash, 8MB PSRAM  [ESP-ESP32-S3-WROOM-1]  (value not drawn)
R7  value 5K1  [R0603_N]
R8  value 5K1  [R0603_N]
R9  value 5K1  [R0603_N]
R10  value 5K1  [R0603_N]
SW11  4.5x4.5mm tact SMD H3,8mm  [WE_430181038816]  (value not drawn)

### Blocks framed on the sheet
ESP32-S3-WROOM-1: C8-C10 MOD1 R7 R8
Peripherals: R9 R10
Debugging: SW11

### Ports
ESP.IO[0..48] (bidir), ESP.RESET (in), I2C (harness I2C), SPI (harness SPI), USB (harness USB)

### Harnesses
I2C: SDA, SCL
USB: D_p, D_n
SPI: CS, CLK, DO, DI

### Nets
3V3_ESP: C9.1 C10.1 MOD1.2(VDD) R7.1 R8.1 R9.1 R10.1
GND: C8.2 C9.2 C10.2 MOD1.1(GND) MOD1.40(GND) MOD1.41(EP-GND) SW11.2
ESP.IO0: MOD1.27(GPIO0,_RTC_GPIO0) R7.2  [project net ESP.BOOT]
ESP.IO1: MOD1.39(GPIO1,_RTC_GPIO1,_TOUCH1,_ADC1_CH0)
ESP.IO2: MOD1.38(GPIO2,_RTC_GPIO2,_TOUCH2,_ADC1_CH1)
ESP.IO3: MOD1.15(GPIO3,_RTC_GPIO3,_TOUCH3,_ADC1_CH2)
ESP.IO4: MOD1.4(GPIO4,_RTC_GPIO4,_TOUCH4,_ADC1_CH3)
ESP.IO5: MOD1.5(GPIO5,_RTC_GPIO5,_TOUCH5,_ADC1_CH4)
ESP.IO6: MOD1.6(GPIO6,_RTC_GPIO6,_TOUCH6,_ADC1_CH5) ; port SPI.DO  [also labelled SPI.MOSI]
ESP.IO7: MOD1.7(GPIO7,_RTC_GPIO7,_TOUCH7,_ADC1_CH6) ; port SPI.CLK  [also labelled SPI.SCLK]
ESP.IO8: MOD1.12(GPIO8,_RTC_GPIO8,_TOUCH8,_ADC1_CH7,_SUBSPICS1) ; port SPI.DI  [also labelled SPI.MISO]
ESP.IO10: MOD1.18(GPIO10,_RTC_GPIO10,_TOUCH10,_ADC1_CH9,_FSPICS0,_FSPIIO4,SUBSPICS0)
ESP.IO11: MOD1.19(GPIO11,_RTC_GPIO11,_TOUCH11,_ADC2_CH0,_FSPID,_FSPIIO5,_SUBSPID)
ESP.IO12: MOD1.20(GPIO12,_RTC_GPIO12,_TOUCH12,_ADC2_CH1,_FSPICLK,_FSPIIO6,_SUBSPICLK)
ESP.IO13: MOD1.21(GPIO13,_RTC_GPIO13,_TOUCH13,_ADC2_CH2,_FSPIQ,_FSPIIO7,_SUBSPIQ)
ESP.IO14: MOD1.22(GPIO14,_RTC_GPIO14,_TOUCH14,_ADC2_CH3,_FSPIWP,_FSPIDQS,_SUBSPIWP)
ESP.IO15: MOD1.8(GPIO15,_RTC_GPIO15,_U0RTS,_ADC2_CH4,_XTAL_32K_P)
ESP.IO16: MOD1.9(GPIO16,_RTC_GPIO16,_U0CTS,_ADC2_CH5,_XTAL_32K_N)
ESP.IO17: MOD1.10(GPIO17,_RTC_GPIO17,_U1TXD,_ADC2_CH6)
ESP.IO21: MOD1.23(GPIO21,_RTC_GPIO21)
ESP.IO38: MOD1.31(GPIO38,_FSPIWP,_SUBSPIWP)  [project net BUZZER]
ESP.IO39: MOD1.32(GPIO39,_MTCK,_CLK_OUT3,_SUBSPICS1)
ESP.IO40: MOD1.33(GPIO40,_MTDO,_CLK_OUT2)
ESP.IO41: MOD1.34(GPIO41,_MTDI,_CLK_OUT1)
ESP.IO42: MOD1.35(GPIO42,_MTMS)
ESP.IO43: MOD1.37(GPIO43,_U0TXD,_CLK_OUT1)
ESP.IO44: MOD1.36(GPIO44,_U0RXD,_CLK_OUT2)
ESP.IO45: MOD1.26(GPIO45)
ESP.IO46: MOD1.16(GPIO46)
ESP.IO47: MOD1.24(GPIO47,_SPICLK_P_DIFF,_SUBSPICLK_P_DIFF)
ESP.IO48: MOD1.25(GPIO48,_SPICLK_N_DIFF,_SUBSPICLK_N_DIFF)  [project net ACC.INT2]
ESP.RESET: C8.1 MOD1.3(EN) R8.2 SW11.1 ; port ESP.RESET
I2C.SCL: MOD1.11(GPIO18,_RTC_GPIO18,_U1RXD,_ADC2_CH7,_CLK_OUT3) R10.2 ; port I2C.SCL
I2C.SDA: MOD1.17(GPIO9,_RTC_GPIO9,_TOUCH9,_ADC1_CH8,_FSPIHD,_SUBSPIHD) R9.2 ; port I2C.SDA
USB.D_n: MOD1.13(GPIO19,_RTC_GPIO19,_U1RTS,_ADC2_CH8,_CLK_OUT2,_USB_D-) ; port USB.D_n
USB.D_p: MOD1.14(GPIO20,_RTC_GPIO20,_U1CTS,_ADC2_CH9,_CLK_OUT1,_USB_D+) ; port USB.D_p

Not connected (* = marked no-connect by the designer): MOD1 28(GPIO35,_SPIIO6,_FSPID,_SUBSPID)* 29(GPIO36,_SPIIO7,_FSPICLK,_SUBSPICLK)* 30(GPIO37,_SPIDQS,_FSPIQ,_SUBSPIQ)*

### Buses and harness runs
bus ESP.IO[0..48] = port ESP.IO[0..48]
harness I2C = port I2C
harness SPI = port SPI
harness USB = port USB

### Notes on the sheet
- BOOT
- GPIO1
- GAME.START
- MIC IN
- '0' on boot → ESP in download mode
- '1' on boot → ESP boots from SPI flash
- I2S MCLK
- SPI MOSI
- LCD CSn
- LCD DC
- IO.BOOT
- Spare IO 5
- if FLOAT on boot → JTAG enabled
- SPI MISO
- SPI SCLK
- I²C SDA
- IR IN
- BADGE.LINK
- (near MOD1) I2S DIN
- (near MOD1) I2S DOUT
- Spare IO 4
- WS2812
- SD CSn
- TP Int
- (near MOD1) USB D-
- (near MOD1) USB D+
- (near MOD1) I2S SCLK
- USB D-
- USB D+
- I²C SCL
- Spare IO 6
- SAO.IO
- IO.DIO/SDA
- IO.INT
- JTAG TCK
- Combined with internal PSRAM
- Do not use these pins
- (near MOD1) U0TXD
- (near MOD1) U0RXD
- IO.DCK/SCL
- Spare IO 1
- Spare IO 0
- LoRa INT
- LoRa Busy
- JTAG TDO
- JTAG TDI
- JTAG TMS
- (near MOD1) GPIO48
- (near MOD1) I2S LRCK
- Acc Int
- LoRa RF SW
- Spare IO 3
- LoRa CSn
- '0' on boot → use 3.3V Flash interface
- '0' on boot → Boot message printing
- USB Interface
- Title
- Revision
- Date
- Dranw By
- Size
- A3
- Sheet
- of
- (in symbol WiFi # MOD ESP32-S3-WROOM-1-N16R8) ESP32-S3-WROOM-1; not available with internal PSRAM

### Library data of the parts
C8 C9 = CAP # 100nF 16V 0603: Capacitor Ceramic; Supplier 1: LCSC; Supplier 3: Generic; Supplier Part Number 1: C282519; Supplier Part Number 3: 100nF 16V 0603 X7R
C10 = CAP # 10uF 10V 0805: Capacitor Ceramic; Supplier 1: Farnell; Supplier Part Number 1: 2320859; Supplier 2: LCSC; Supplier 3: Generic; Supplier Part Number 2: C17024; Supplier Part Number 3: 10uF 10V 0805 X7R
MOD1 = WiFi # MOD ESP32-S3-WROOM-1-N16R8: WiFi # MOD ESP32-S3-WROOM-1; Value: ESP32-S3-WROOM-1-N16R8; Supplier 1: Espressif; Supplier Part Number 1: ESP32-S3-WROOM-1-N16R8; Supplier 2: Digi-key; Supplier Part Number 2: 1965-ESP32-S3-WROOM-1-N16R8DKR-ND
R7-R10 = RES # 5K1 0603: Supplier 1: Farnell; Supplier Part Number 1: 2845922; Supplier 2: LCSC; Supplier 3: Generic; Supplier Part Number 2: C112314; Supplier Part Number 3: 5K1 1% 0603
SW11 = SW # TACT small 4.5x4.5mm SMD WS-TASV: Value: 430181038816; Supplier 1: Wurth; Supplier Part Number 1: 430181038816; Supplier 2: Mouser; Supplier Part Number 2: 710-430181038816; Supplier 3: LCSC; Supplier Part Number 3: C174049

## Sheet Fri3D_2026_Audio.SchDoc: Audio
size A3; Date: 27/02/2026; DrawnBy: Wim Van Gool; DocumentNumber: 4; Revision: 01; SheetNumber: 4; SheetTotal: 5
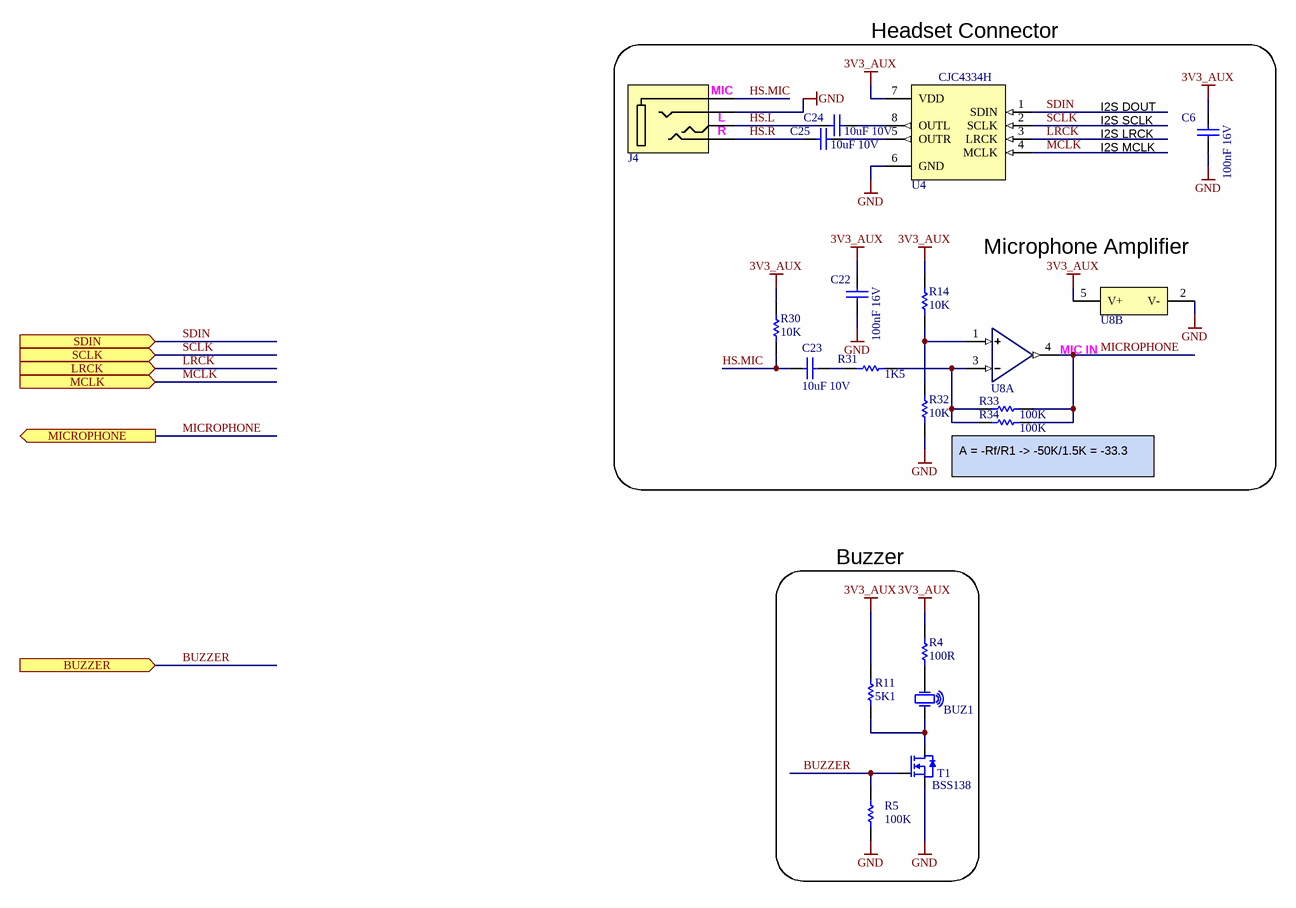
[diagram p4: Fri3D_2026_Audio.SchDoc]

### Parts
BUZ1  12x12x3mm Piezo Buzzer Transducer 81dB  [CUI_CMT-1203-SMT]  (value not drawn)
C6  value 100nF 16V  [C0603_N]
C22  value 100nF 16V  [C0603_N]
C23  value 10uF 10V  [C0805_N]
C24  value 10uF 10V  [C0805_N]
C25  value 10uF 10V  [C0805_N]
J4  3.5mm jack, black, 4 contacts 15mm  [CAX_PJ-327F-5PS]  (value not drawn)
R4  value 100R  [R0603_N]
R5  value 100K  [R0603_N]
R11  value 5K1  [R0603_N]  (hidden comment: RESISTOR)
R14  value 10K  [R0603_N]
R30  value 10K  [R0603_N]
R31  value 1K5  [R0603_N]
R32  value 10K  [R0603_N]
R33  value 100K  [R0603_N]
R34  value 100K  [R0603_N]
T1  value BSS138  [SOT23-3]  (hidden comment: 0.2A N-Ch MOSFET Vgs 3.2)
U4  value CJC4334H  [SOIC_N_8]  (hidden comment: I²S 24bit 192kHz 3V~3.6V DAC)
U8  Single, 30-V, 1-MHz operational amplifier  [TI_DBV_R-PDSO-G5]  (value not drawn)  (parts A,B of 2)

### Blocks framed on the sheet
Buzzer: BUZ1 R4 R5 R11 T1

### Ports
BUZZER (in), LRCK (in), MCLK (in), MICROPHONE (out), SCLK (in), SDIN (in)

### Nets
3V3_AUX: C6.1 C22.1 R4.2 R11.2 R14.1 R30.1 U4.7(VDD) U8.5(V+)
GND: C6.2 C22.2 J4.2(Ring) R5.2 R32.2 T1.2(S) U4.6(GND) U8.2(V-)
BUZZER: R5.1 T1.1(G) ; port BUZZER
HS.L: C24.1 J4.4(Tip)
HS.MIC: C23.1 J4.1(Sleeve) R30.2
HS.R: C25.1 J4.3(Ring)
LRCK: U4.3(LRCK) ; port LRCK  [project net ESP.IO47]
MCLK: U4.4(MCLK) ; port MCLK  [project net ESP.IO17]
MICROPHONE: R33.1 R34.1 U8.4(OUT) ; port MICROPHONE  [project net ESP.IO1]
SCLK: U4.2(SCLK) ; port SCLK  [project net ESP.IO2]
SDIN: U4.1(SDIN) ; port SDIN  [project net ESP.IO16]
NetBUZ1_1: BUZ1.1(OSC1) R11.1 T1.3(D)
NetBUZ1_2: BUZ1.2(OSC2) R4.1
NetC23_2: C23.2 R31.2
NetC24_2: C24.2 U4.8(OUTL)
NetC25_2: C25.2 U4.5(OUTR)
NetR14_2: R14.2 R32.1 U8.1(+)
NetR31_1: R31.1 R33.2 R34.2 U8.3(-)

### Notes on the sheet
- Headset Connector
- (near J4) L
- (near J4) R
- (near J4) MIC
- I2S DOUT
- I2S SCLK
- I2S LRCK
- I2S MCLK
- Microphone Amplifier
- (near U8) MIC IN
- (near R34) A = -Rf/R1 -> -50K/1.5K = -33.3
- Title
- Revision
- Date
- Dranw By
- Size
- A3
- Sheet
- of

### Library data of the parts
BUZ1 = BUZ # CUI CMT-1203-SMT: Crystal Oscillator; Value: CMT-1203-SMT; Supplier 1: Digi-key; Supplier Part Number 1: 102-2197-1-ND; Supplier 2: LCSC; Supplier Part Number 2: C409829; Supplier 3: LCSC; Supplier Part Number 3: C391037
C6 C22 = CAP # 100nF 16V 0603: Capacitor Ceramic; Supplier 1: LCSC; Supplier 3: Generic; Supplier Part Number 1: C282519; Supplier Part Number 3: 100nF 16V 0603 X7R
C23-C25 = CAP # 10uF 10V 0805: Capacitor Ceramic; Supplier 1: Farnell; Supplier Part Number 1: 2320859; Supplier 2: LCSC; Supplier 3: Generic; Supplier Part Number 2: C17024; Supplier Part Number 3: 10uF 10V 0805 X7R
J4 = AUDIO JACK # 3.5 4c 15mm PJ-327F-5PS: Value: PJ-327F-5PS; Supplier 1: LCSC; Supplier Part Number 1: C50176645
R4 = RES # 100R 0603: Supplier 1: Farnell; Supplier 2: LCSC; Supplier 3: Generic; Supplier Part Number 1: 2446544; Supplier Part Number 2: C22775; Supplier Part Number 3: 100R 1% 0603
R5 R33 R34 = RES # 100K 0603: Supplier 3: Generic; Supplier Part Number 3: 100K 1% 0603; Supplier 1: LCSC; Supplier 2: LCSC; Supplier Part Number 1: C25803; Supplier Part Number 2: C14675
R11 = RES # 5K1 0603: Supplier 3: Generic; Supplier Part Number 3: 5K1 1% 0603; Supplier 1: Farnell; Supplier 2: LCSC; Supplier Part Number 1: 2845922; Supplier Part Number 2: C112314; Description: RES # 5K1 0603
R14 R30 R32 = RES # 10K 0603: Supplier 1: Farnell; Supplier Part Number 1: 2502397; Supplier 2: LCSC; Supplier 3: Generic; Supplier Part Number 2: C25804; Supplier Part Number 3: 10K 1% 0603
R31 = RES # 1K5 0603: Supplier 3: Generic; Supplier Part Number 3: 1K5 1% 0603; Supplier 1: LCSC; Supplier 2: LCSC; Supplier Part Number 1: C2930050; Supplier Part Number 2: C114668
T1 = BSS138 N-Ch MOSFET 0.2A 3.2Vgs 60Vds: Supplier 1: Farnell; Supplier Part Number 1: 2432717
U4 = DAC # I2S CJC4334H: I2S Stereo DAC with 24-Bit, 192 kHz Stereo D/A Converter; Supplier 1: LCSC; Supplier Part Number 1: C41417670
U8 = OP # LM321: =Description; Value: LM321; Supplier 1: LCSC; Supplier Part Number 1: C18164494; Supplier 2: LCSC; Supplier Part Number 2: C51026323; Supplier 3: LCSC; Supplier Part Number 3: C18723612

## Nets that join several sheets
3V3_AUX: Fri3D_2026_02 (9 pins), Fri3D_2026_Peripherals (21 pins), Fri3D_2026_Power (C21.1 D11.1 D12.1 U7.5), Fri3D_2026_Audio (8 pins)
3V3_ESP: Fri3D_2026_Peripherals (5 pins), Fri3D_2026_Power (R1.1 U6.5), Fri3D_2026_ESP32 (7 pins)
GND: Fri3D_2026_02 (22 pins), Fri3D_2026_Peripherals (42 pins), Fri3D_2026_Power (16 pins), Fri3D_2026_ESP32 (7 pins), Fri3D_2026_Audio (8 pins)
VBAT: Fri3D_2026_Peripherals (R12.1), Fri3D_2026_Power (C17.1 P4.2 T6.3 U5.5)
VSYS: Fri3D_2026_02 (J1.1 P10.11 R36.1), Fri3D_2026_Peripherals (7 pins), Fri3D_2026_Power (6 pins)
VUSB: Fri3D_2026_02 (J2.A4 J2.A9 J2.B4 J2.B9), Fri3D_2026_Peripherals (R28.1), Fri3D_2026_Power (7 pins)
ACC.INT2: Fri3D_2026_Peripherals (R46.2), Fri3D_2026_ESP32 (MOD1.25)
AIN0: Fri3D_2026_02 (R40.1 R41.2 R42.2), Fri3D_2026_Peripherals (U2.5)
AUX.PWR: Fri3D_2026_Peripherals (U2.17), Fri3D_2026_Power (R1.2 U7.3)
BUZZER: Fri3D_2026_ESP32 (MOD1.31), Fri3D_2026_Audio (R5.1 T1.1)
~{CHRG}: Fri3D_2026_Peripherals (U2.12), Fri3D_2026_Power (R24.2 U5.7)
CHG.~{STDBY}: Fri3D_2026_Peripherals (U2.13), Fri3D_2026_Power (R23.2 U5.6)
ESP.BOOT: Fri3D_2026_Peripherals (SW6.1), Fri3D_2026_ESP32 (MOD1.27 R7.2)
ESP.IO1: Fri3D_2026_ESP32 (MOD1.39), Fri3D_2026_Audio (R33.1 R34.1 U8.4)
ESP.IO2: Fri3D_2026_02 (P10.6), Fri3D_2026_ESP32 (MOD1.38), Fri3D_2026_Audio (U4.2)
ESP.IO3: Fri3D_2026_Peripherals (TP1.1 U2.27), Fri3D_2026_ESP32 (MOD1.15)
ESP.IO4: Fri3D_2026_Peripherals (P1.12), Fri3D_2026_ESP32 (MOD1.4)
ESP.IO5: Fri3D_2026_Peripherals (P1.13), Fri3D_2026_ESP32 (MOD1.5)
ESP.IO6: Fri3D_2026_02 (MOD2.3), Fri3D_2026_Peripherals (J3.3 P1.11 R20.2), Fri3D_2026_ESP32 (MOD1.6)
ESP.IO7: Fri3D_2026_02 (MOD2.4), Fri3D_2026_Peripherals (J3.5 P1.9 R18.2), Fri3D_2026_ESP32 (MOD1.7)
ESP.IO8: Fri3D_2026_02 (MOD2.2), Fri3D_2026_Peripherals (J3.7 R19.2), Fri3D_2026_ESP32 (MOD1.12)
ESP.IO10: Fri3D_2026_02 (R35.2 T9.2), Fri3D_2026_ESP32 (MOD1.18)
ESP.IO11: Fri3D_2026_Peripherals (D15.1), Fri3D_2026_ESP32 (MOD1.19)
ESP.IO12: Fri3D_2026_Peripherals (D1.4), Fri3D_2026_ESP32 (MOD1.20)
ESP.IO13: Fri3D_2026_Peripherals (P1.17), Fri3D_2026_ESP32 (MOD1.21)
ESP.IO14: Fri3D_2026_Peripherals (J3.2 R15.2), Fri3D_2026_ESP32 (MOD1.22)
ESP.IO15: Fri3D_2026_02 (P10.7), Fri3D_2026_ESP32 (MOD1.8)
ESP.IO16: Fri3D_2026_02 (P10.8), Fri3D_2026_ESP32 (MOD1.9), Fri3D_2026_Audio (U4.1)
ESP.IO17: Fri3D_2026_02 (P10.10), Fri3D_2026_ESP32 (MOD1.10), Fri3D_2026_Audio (U4.4)
ESP.IO21: Fri3D_2026_02 (P6.6), Fri3D_2026_ESP32 (MOD1.23)
ESP.IO39: Fri3D_2026_Peripherals (R50.2 U2.25), Fri3D_2026_ESP32 (MOD1.32)
ESP.IO40: Fri3D_2026_02 (MOD2.12), Fri3D_2026_ESP32 (MOD1.33)
ESP.IO41: Fri3D_2026_02 (MOD2.11), Fri3D_2026_ESP32 (MOD1.34)
ESP.IO42: Fri3D_2026_Peripherals (R51.2 U2.24), Fri3D_2026_ESP32 (MOD1.35)
ESP.IO43: Fri3D_2026_02 (P10.4), Fri3D_2026_ESP32 (MOD1.37)
ESP.IO44: Fri3D_2026_02 (P10.3), Fri3D_2026_ESP32 (MOD1.36)
ESP.IO45: Fri3D_2026_02 (MOD2.6), Fri3D_2026_ESP32 (MOD1.26)
ESP.IO46: Fri3D_2026_02 (MOD2.1), Fri3D_2026_ESP32 (MOD1.16)
ESP.IO47: Fri3D_2026_02 (P10.5), Fri3D_2026_ESP32 (MOD1.24), Fri3D_2026_Audio (U4.3)
I2C.SCL: Fri3D_2026_02 (P2.4 P6.4 P10.12), Fri3D_2026_Peripherals (P1.19 U1.13), Fri3D_2026_ESP32 (MOD1.11 R10.2)
I2C.SDA: Fri3D_2026_02 (P2.3 P6.3 P10.9), Fri3D_2026_Peripherals (P1.18 U1.14), Fri3D_2026_ESP32 (MOD1.17 R9.2)
LED.DOUT: Fri3D_2026_02 (P6.5), Fri3D_2026_Peripherals (D5.2)
LORA.RESET: Fri3D_2026_02 (MOD2.5), Fri3D_2026_Peripherals (U2.16)
USB.D_n: Fri3D_2026_02 (J2.A7 J2.B7), Fri3D_2026_ESP32 (MOD1.13)
USB.D_p: Fri3D_2026_02 (J2.A6 J2.B6), Fri3D_2026_ESP32 (MOD1.14)

## Assembly variants
Default: not fitted J1 P5 P6 P8 P9